# Altium schematic sheet INPUT_OUTPUT.SchDoc: FHGR_A3_landscape
size A3; Date: 18.07.2017; DrawnBy: G.P. Catregn; Organization: HTW Chur; Address1: Pulvermühlestrasse 57; Address2: 7004 Chur; Address3: Switzerland; DocumentNumber: 1; Revision: V1.0; SheetNumber: 2; SheetTotal: 3; DocumentName: HTW Template
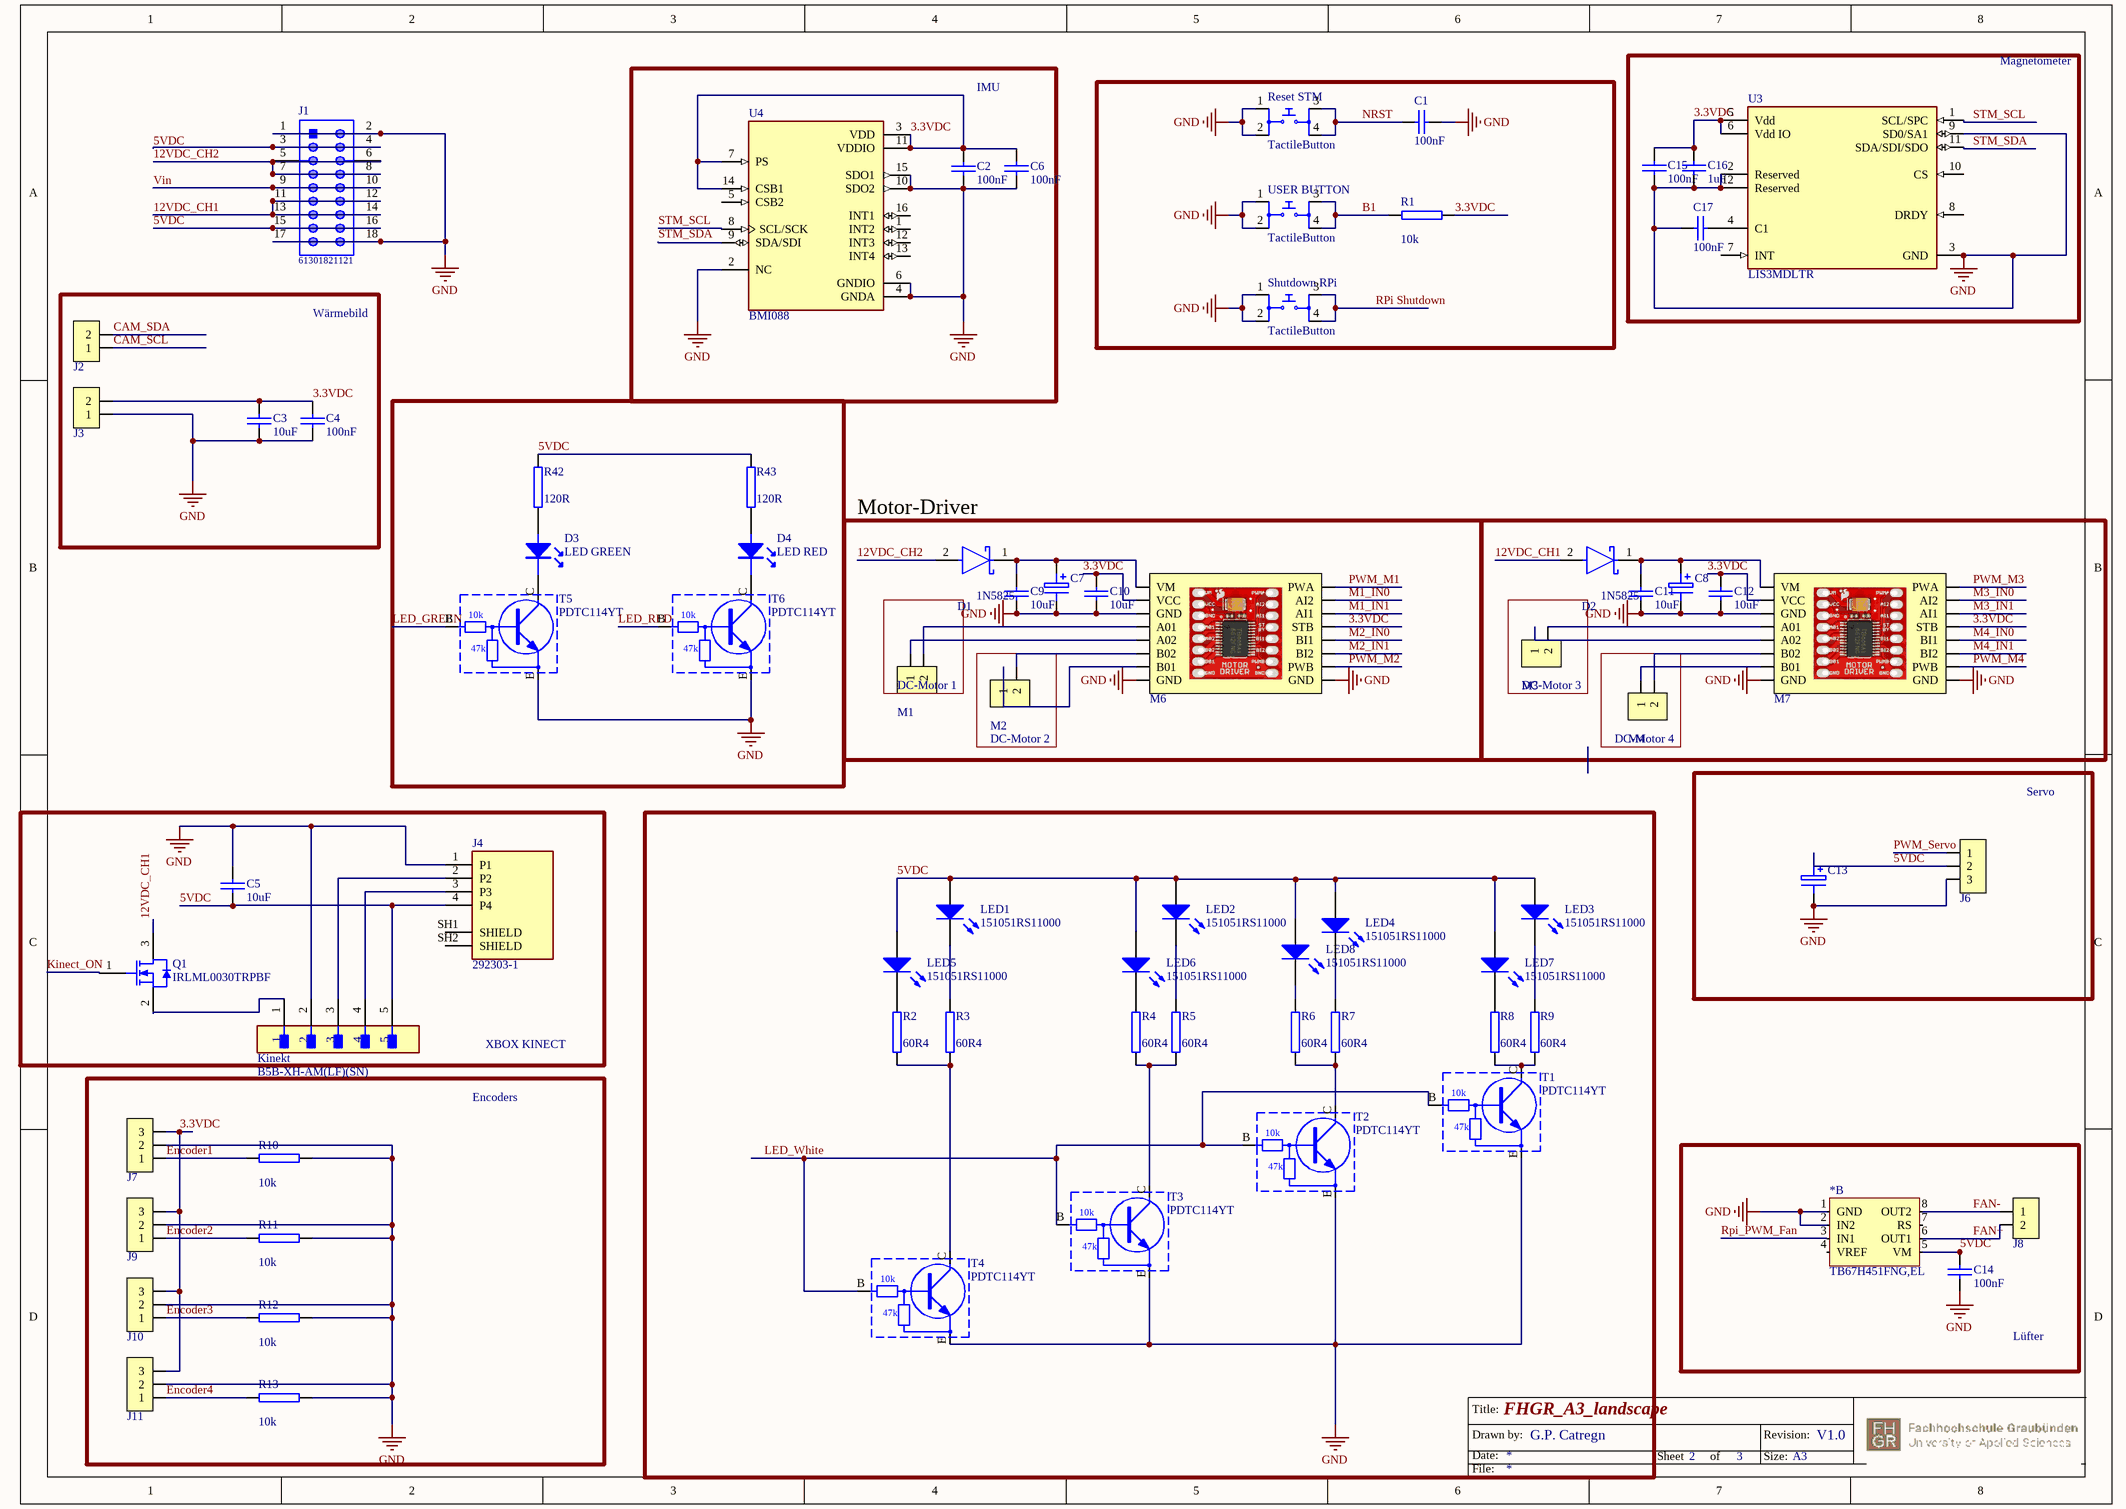
[diagram p0: INPUT_OUTPUT.SchDoc]

## Parts
*  TB67H451FNG,EL  [SOIC127P600X170_HS-9N]  (part B of 2)
C1  value 100nF  [0603]  (hidden comment: C 100nF 0603)
C2  value 100nF  [0603]  (hidden comment: C 100nF 0603)
C3  value 10uF  [0603]  (hidden comment: C 10uF 0603)
C4  value 100nF  [0603]  (hidden comment: C 100nF 0603)
C5  value 10uF  [0603]  (hidden comment: C 10uF 0603)
C6  value 100nF  [0603]  (hidden comment: C 100nF 0603)
C7  C 100uF ALUM  [PCAP_8x10-ELEC00]  (value not drawn)
C8  C 100uF ALUM  [PCAP_8x10-ELEC00]  (value not drawn)
C9  value 10uF  [0603]  (hidden comment: C 10uF 0603)
C10  value 10uF  [0603]  (hidden comment: C 10uF 0603)
C11  value 10uF  [0603]  (hidden comment: C 10uF 0603)
C12  value 10uF  [0603]  (hidden comment: C 10uF 0603)
C13  C 100uF ALUM  [PCAP_8x10-ELEC00]  (value not drawn)
C14  value 100nF  [0603]  (hidden comment: C 100nF 0603)
C15  value 100nF  [0603]  (hidden comment: C 100nF 0603)
C16  value 1uF  [0603]  (hidden comment: C 1uF 0603)
C17  value 100nF  [0603]  (hidden comment: C 100nF 0603)
D1  1N5825  [Microsemi_1N5825_0]  (value not drawn)
D2  1N5825  [Microsemi_1N5825_0]  (value not drawn)
D3  LED GREEN  [LED_1206]
D4  LED RED  [LED_1206]
J1  61301821121  [61301821121]
J2  2Pin_Male  [Header1x2_254]  (value not drawn)
J3  2Pin_Male  [Header1x2_254]  (value not drawn)
J4  292303-1  [TE_292303-1]
J6  3Pin_Male  [Header1x3_254]  (value not drawn)
J7  3Pin_Male  [Header1x3_254]  (value not drawn)
J8  2Pin_Male  [Header1x2_254]  (value not drawn)
J9  3Pin_Male  [Header1x3_254]  (value not drawn)
J10  3Pin_Male  [Header1x3_254]  (value not drawn)
J11  3Pin_Male  [Header1x3_254]  (value not drawn)
Kinekt  B5B-XH-AM(LF)(SN)  [FP-B5B-XH-AM_LF_SN-MFG]
LED1  151051RS11000  [Type 5mm]
LED2  151051RS11000  [Type 5mm]
LED3  151051RS11000  [Type 5mm]
LED4  151051RS11000  [Type 5mm]
LED5  151051RS11000  [Type 5mm]
LED6  151051RS11000  [Type 5mm]
LED7  151051RS11000  [Type 5mm]
LED8  151051RS11000  [Type 5mm]
M1  2Pin_Female  [OSTTE020104]  (value not drawn)
M2  2Pin_Female  [OSTTE020104]  (value not drawn)
M3  2Pin_Female  [OSTTE020104]  (value not drawn)
M4  2Pin_Female  [OSTTE020104]  (value not drawn)
M6  SPARKFUN_ROB_14451  [SPARKFUN_ROB_14451]  (value not drawn)
M7  SPARKFUN_ROB_14451  [SPARKFUN_ROB_14451]  (value not drawn)
Q1  IRLML0030TRPBF  [INTR-SOT-23-3_V]
R1  value 10k  [0805]  (hidden comment: R 10K 0805)
R2  value 60R4  [0805]  (hidden comment: R 60R4 0805)
R3  value 60R4  [0805]  (hidden comment: R 60R4 0805)
R4  value 60R4  [0805]  (hidden comment: R 60R4 0805)
R5  value 60R4  [0805]  (hidden comment: R 60R4 0805)
R6  value 60R4  [0805]  (hidden comment: R 60R4 0805)
R7  value 60R4  [0805]  (hidden comment: R 60R4 0805)
R8  value 60R4  [0805]  (hidden comment: R 60R4 0805)
R9  value 60R4  [0805]  (hidden comment: R 60R4 0805)
R10  value 10k  [0805]  (hidden comment: R 10K 0805)
R11  value 10k  [0805]  (hidden comment: R 10K 0805)
R12  value 10k  [0805]  (hidden comment: R 10K 0805)
R13  value 10k  [0805]  (hidden comment: R 10K 0805)
R42  value 120R  [0805]  (hidden comment: R 120R 0805)
R43  value 120R  [0805]  (hidden comment: R 120R 0805)
Reset_STM  TactileButton  [TactileButton-6x6mm]
Shutdown_RPi  TactileButton  [TactileButton-6x6mm]
T1  PDTC114YT  [SOT-23]
T2  PDTC114YT  [SOT-23]
T3  PDTC114YT  [SOT-23]
T4  PDTC114YT  [SOT-23]
T5  PDTC114YT  [SOT-23]
T6  PDTC114YT  [SOT-23]
U3  LIS3MDLTR  [FP-VFLGA-12-8365767-MFG]
U4  BMI088  [PQFN50P450X300X100-16N]
USER_BUTTON  TactileButton  [TactileButton-6x6mm]

## Blocks framed on the sheet
IMU: C2 C6 U4
Magnetometer: C15-C17 U3
Wärmebild: C3 C4 J2 J3
Motor-Driver: C7 C9 C10 D1 M6
DC-Motor 1: M1
DC-Motor 3: M3
DC-Motor 2: M2
DC-Motor 4: M4
Servo: C13 J6
XBOX KINECT: C5 J4 Kinekt Q1
Encoders: J7 J9-J11 R10-R13
Lüfter: * C14 J8

## Nets
GND: *.1(GND) *.2(IN2) C1.2 C2.2 C3.2 C4.2 C5.1 C6.2 C7.2 C8.2 C9.2 C10.2 C11.2 C12.2 C13.2 C14.2 C15.2 C16.2 C17.1 J1.1 J1.2 J1.17 J1.18 J3.1 J4.1(P1) J6.3 J7.2 J9.2 J10.2 J11.2 Kinekt.2 M6.3(GND) M6.8(GND) M6.9(GND) M7.3(GND) M7.8(GND) M7.9(GND) R10.2 R11.2 R12.1 R13.2 Reset_STM.1 Reset_STM.2 Shutdown_RPi.1 Shutdown_RPi.2 T1.E T2.E T3.E T4.E T5.E T6.E U3.2(Reserved) U3.3(GND) U3.9(SD0/SA1) U3.12(Reserved) U4.2(NC) U4.4(GNDA) U4.6(GNDIO) U4.10(SDO2) U4.15(SDO1) USER_BUTTON.1 USER_BUTTON.2
3.3VDC: C2.1 C3.1 C4.1 C6.1 C10.1 C12.1 C15.1 C16.1 J3.2 J7.3 J9.3 J10.3 J11.3 M6.2(VCC) M6.13(STB) M7.2(VCC) M7.13(STB) R1.2 U3.5(Vdd) U3.6(Vdd_IO) U4.3(VDD) U4.7(PS) U4.11(VDDIO) U4.14(CSB1)
5VDC: *.5(VM) C5.2 C13.1 C14.1 J1.3 J1.4 J1.15 J1.16 J4.4(P4) J6.2 Kinekt.5 LED1.2(A) LED2.2(A) LED3.2(A) LED4.2(A) LED5.2(A) LED6.2(A) LED7.2(A) LED8.2(A) R42.2 R43.2
12VDC_CH1: D2.2(A) J1.11 J1.12 J1.13 J1.14 Q1.3(D)
12VDC_CH2: D1.2(A) J1.5 J1.6 J1.7 J1.8
B1: R1.1 USER_BUTTON.3 USER_BUTTON.4
CAM_SCL: J2.1
CAM_SDA: J2.2
Encoder1: J7.1 R10.1
Encoder2: J9.1 R11.1
Encoder3: J10.1 R12.2
Encoder4: J11.1 R13.1
FAN+: *.6(OUT1) J8.2
FAN-: *.8(OUT2) J8.1
Kinect_ON: Q1.1(G)
LED_GREEN: T5.B
LED_RED: T6.B
LED_White: T1.B T2.B T3.B T4.B
M1_IN0: M6.15(AI2)
M1_IN1: M6.14(AI1)
M2_IN0: M6.12(BI1)
M2_IN1: M6.11(BI2)
M3_IN0: M7.15(AI2)
M3_IN1: M7.14(AI1)
M4_IN0: M7.12(BI1)
M4_IN1: M7.11(BI2)
NRST: C1.1 Reset_STM.3 Reset_STM.4
PWM_M1: M6.16(PWA)
PWM_M2: M6.10(PWB)
PWM_M3: M7.16(PWA)
PWM_M4: M7.10(PWB)
PWM_Servo: J6.1
RPi Shutdown: Shutdown_RPi.3 Shutdown_RPi.4
Rpi_PWM_Fan: *.3(IN1)
STM_SCL: U3.1(SCL/SPC) U4.8(SCL/SCK)
STM_SDA: U3.11(SDA/SDI/SDO) U4.9(SDA/SDI)
Vin: J1.9 J1.10
NetC7_1: C7.1 C9.1 D1.1(C) M6.1(VM)
NetC8_1: C8.1 C11.1 D2.1(C) M7.1(VM)
NetC17_2: C17.2 U3.4(C1)
NetD3_A: D3.A R42.1
NetD3_K: D3.K T5.C
NetD4_A: D4.A R43.1
NetD4_K: D4.K T6.C
NetJ4_2: J4.2(P2) Kinekt.3
NetJ4_3: J4.3(P3) Kinekt.4
NetKinekt_1: Kinekt.1 Q1.2(S)
NetLED1_1: LED1.1(K) R3.2
NetLED2_1: LED2.1(K) R5.2
NetLED3_1: LED3.1(K) R9.2
NetLED4_1: LED4.1(K) R7.2
NetLED5_1: LED5.1(K) R2.2
NetLED6_1: LED6.1(K) R4.2
NetLED7_1: LED7.1(K) R8.2
NetLED8_1: LED8.1(K) R6.2
NetM1_1: M1.1 M6.5(A02)
NetM1_2: M1.2 M6.4(A01)
NetM2_1: M2.1 M6.7(B01)
NetM2_2: M2.2 M6.6(B02)
NetM3_1: M3.1 M7.5(A02)
NetM3_2: M3.2 M7.4(A01)
NetM4_1: M4.1 M7.7(B01)
NetM4_2: M4.2 M7.6(B02)
NetR2_1: R2.1 R3.1 T4.C
NetR4_1: R4.1 R5.1 T3.C
NetR6_1: R6.1 R7.1 T2.C
NetR8_1: R8.1 R9.1 T1.C

Not connected (* = marked no-connect by the designer): * 4(VREF) 7(RS); J4 SH1(SHIELD) SH2(SHIELD); U3 7(INT) 8(DRDY) 10(CS); U4 1(INT2) 5(CSB2) 12(INT3) 13(INT4) 16(INT1)

## Notes on the sheet
- Drawn by:
- Title:
- Date:
- Sheet
- of
- Size:
- Revision:
- A3
- File:
- (in symbol T_PDTC114YT) 10k; 47k

## Library data of the parts
C1 C2 C4 C6 C14 C15 C17 = C_100nF_0603: TempKoeff: Y5V; Tolerance: -20%/+80%; Voltage: 50V; Part ID: C_100nF_0603; Price 1pc (CHF): 0.1; Supplier 1: Digi-Key; Supplier Part Number 1: 1276-1012-1-ND
C3 C5 C9-C12 = C_10uF_0603: TempKoeff: X5R; Tolerance: 10%; Voltage: 16V; Part ID: C_10uF_0603; Price 1pc (CHF): 0.40; Supplier 1: Digi-Key; Supplier Part Number 1: 490-12317-1-ND
C7 C8 C13 = C_100uF_ALUM: Tolerance: 20%; Voltage: 50V; VALUE: 100uF; Part ID: C_100uF_ALUM; Price 1pc (CHF): 0.51; Supplier 1: Digi-Key; Supplier Part Number 1: 493-2226-1-ND
C16 = C_1uF_0603: TempKoeff: X7R; Tolerance: 10%; Voltage: 25V; Part ID: C_1uF_0603; Price 1pc (CHF): 0.29; Supplier 1: Digi-Key; Supplier Part Number 1: 1276-6617-1-ND
D3 = LED_GREEN_1206: Peak Wavelenght: 565nm; Part ID: LED_GREEN_1206; Price 10pcs: 0.226; Supplier 1: Digi-Key; Supplier Part Number 1: 67-1357-1-ND; ComponentLink1Description: Datasheet; ComponentLink1URL: https://media.digikey.com/pdf/Data%20Sheets/Lite-On%20PDFs/LTST-C230KGKT.pdf
D4 = LED_RED_1206: Peak Wavelenght: 639nm; Part ID: LED_RED_1206; Price 10pcs: 0.233; Supplier 1: Digi-Key; Supplier Part Number 1: 160-1457-1-ND; ComponentLink1Description: Datasheet; ComponentLink1URL: https://media.digikey.com/pdf/Data%20Sheets/Lite-On%20PDFs/LTST-C230KRKT.pdf
J1 = CMP-1502-01101-1: THT Vertical Pin Header WR-PHD, Pitch 2.54 mm, Dual Row, 18 pins; Manufacturer: Wurth Elektronik; Withstanding Voltage: 500VAC; Pin Number: 18; Pitch: 2.54mm; Rated Current: 3A; Contact Resistance: 20mOhm; Gender: Male; Working Voltage: 250VAC; Publisher: WurthElektronik; Packaging: Bag; Row Number: Dual; Datasheet URL: https://katalog.we-online.de/em/datasheet/6130xx21121.pdf; Mounting Technology: THT; Orientation: Vertical; Part Number: 61301821121; Package Reference: 61301821121; Manufacturer URL: http://www.we-online.de; Operating Temperature: -40to105degC
J2 J3 J8 = Header_2: Part ID: Header_2; Price 1pc (CHF): 0.13; Supplier 1: Digi-Key; ComponentLink1Description: Datasheet; ComponentLink1URL: https://katalog.we-online.de/em/datasheet/6130xx11121.pdf; Supplier Part Number 1: 732-5315-ND
J4 = 292303-1: CONN USB RECEPT R/A TYPE A 4POS; Value: *; MP: 292303-1; Package: None; Availability: Unavailable; Price: None
J6 J7 J9-J11 = Header_3: Part ID: Header_3; Price 1pc (CHF): 0.12; Supplier 1: Digi-Key; ComponentLink1Description: Datasheet; ComponentLink1URL: https://www.we-online.com/katalog/datasheet/6130xx11121.pdf; Supplier Part Number 1: 732-5316-ND
Kinekt = CMP-17439-000304-1: CONN HEADER VERT 5POS 2.5MM; Mated Stacking Heights: 9.8mm; Voltage Rating: 250V; Max Current Rating: 3A; Number of Positions: 5; Contact Resistance: 20mR; Depth: 5.75mm; Connector Type: Header; Color: Green; Insulation Material: Nylon; Contact Plating: Copper; Length: 14.9mm; Fastening Type: Detent; Contact Material: Brass; Number of Rows: 1; Contact Type: Male Pin; Housing Material: Polyamide; Housing Color: White; Lead Free: Lead Free; Max Voltage Rating (AC): 250V; Mount: Through Hole; Contact Shape: Square; Min Operating Temperature: -25°C; Packaging: Bulk; Orientation: Straight; Insulation Color: Natural; Series: XH; Flammability Rating: UL94 V-0; Contact Finish - Mating: TIN; Max Operating Temperature: 85°C; Termination: Solder; Pitch: 2.5mm
LED1-LED8 = CMP-1488-00008-1: THT LED round mono-color color lens, WL-TMRW, Red; Manufacturer: Wuerth Elektronik; PackageReference: Type 5mm; PartNumber: 151051RS11000; ComponentLink2URL: http://katalog.we-online.de/pbs/datasheet/7448042001.pdfhttp://katalog.we-online.de/pbs/datasheet/7448042001.pdfhttp://katalog.we-online.de/pbs/datasheet/7448042001.pdfhttp://katalog.we-online.de/pbs/datasheet/151051RS11000.pdf; ComponentLink1URL: http://www.we-online.com; ComponentLink1Description: Manufacturer URL; ComponentLink2Description: Datasheet; Emitting color: Red
M1-M4 = Terminal_2Pin: Part ID: Terminal_2Pin; Price 1pc (CHF): 0.69; Supplier 1: Digi-Key; ComponentLink1Description: Datasheet; ComponentLink1URL: https://www.on-shore.com/wp-content/uploads/OSTTEXX0104.pdf; Supplier Part Number 1: ED2740-ND
M6 M7 = SPARKFUN_ROB_14451: Dual Motor Driver; Stecker: 2 x 732-5321-ND; Buchse: 2 x SAM1213-08-ND; Part ID: SPARKFUN_ROB_14451; Price 1pc (CHF): 4.5; Supplier 1: Digi-Key; ComponentLink1Description: Datasheet; ComponentLink1URL: https://media.digikey.com/pdf/Data%20Sheets/Sparkfun%20PDFs/ROB-14451_Web.pdf; Supplier Part Number 1: 1568-1756-ND
Q1 = CMP-2000-06483-1: HEXFET(R) Power MOSFET, 1.3 W, 4.4 ns, -55 to 150 degC, 3-Pin SOT-23, RoHS, Tape and Reel; Manufacturer: International Rectifier; Maximum Drain Source Resistance: 0.027Ω; Transistor Configuration: Single; Channel Mode: Enhancement; Maximum Power Dissipation: 1.3W; Typical Input Capacitance @ Vds: 382pF@15V; Maximum Gate Source Voltage: ±20V; Number of Elements per Chip: 1; Transistor Material: Si; Maximum Gate Threshold Voltage: 2.3V; Typical Turn-On Delay Time: 5.2ns; Maximum Drain Source Voltage: 30V; Typical Turn-Off Delay Time: 7.4ns; Minimum Gate Threshold Voltage: 1.3V; Channel Type: N; Typical Gate Charge @ Vgs: 2.6nC@4.5V; Maximum Continuous Drain Current: 5.3A; Pin Count: 3; Mounting Technology: SurfaceMount; Datasheet URL: https://datasheet.ciiva.com/4442/irlml0030pbf-90019-4442451.pdf; Datasheet Version: 02/2012; Maximum Operating Temperature: +150°C; Category: PowerMOSFET; Package Description: 3-Pin Small Outline Transistor, Body 2.92 x 1.3 mm, Pitch 0.95 mm; Manufacturer URL: http://internationalrectifier.com/; Height: 1.02mm; Minimum Operating Temperature: -55°C; Dimensions: 3.04x1.4x1.02mm; Package Reference: SOT-23-3; Package Type: SOT-23; Mounting Type: SurfaceMount; Length: 3.04mm; Width: 1.4mm
R1 R10-R13 = R_10k_0805: Tolerance: 1%; Power Dissipation: 125mW; Part ID: R_10k_0805; Price 10pcs (CHF): 0.021; Supplier 1: Digi-Key; Supplier Part Number 1: 311-10.0KCRCT-ND
R2-R9 = R_60R4_0805: Tolerance: 1%; Power Dissipation: 125mW; Part ID: R_60R4_0805; Price 10pcs (CHF): 0.042; Supplier 1: Digi-Key; Supplier Part Number 1: 311-60.4CRCT-ND
R42 R43 = R_120R_0805: Tolerance: 1%; Power Dissipation: 125mW; Part ID: R_120R_0805; Price 10pcs (CHF): 0.046; Supplier 1: Digi-Key; Supplier Part Number 1: A129738CT-ND
Reset_STM Shutdown_RPi USER_BUTTON = TactileButton: Voltage: 12V; Current: 50mA; Part ID: TactileButton; Price 1pc (CHF): 0.59; Dimension: 6.2mmx6.2mmx4.3mm; Supplier 1: Digi-Key; ComponentLink1Description: Datasheet; ComponentLink1URL: https://media.digikey.com/pdf/Data%20Sheets/APEM%20Components%20PDFs/ADTS6,%20ADTSM,%20AKTSC6%20Series.pdf; Supplier Part Number 1: 679-2380-1-ND
T1-T6 = T_PDTC114YT: Frequency: 230MHz; Voltage: 50V; Current: 100mA; Power Dissipation: 250mW; Part ID: T_PDTC114YT; Price 1pc (CHF): 0.18; ComponentLink1URL: https://assets.nexperia.com/documents/data-sheet/PDTC114Y_SER.pdf; ComponentLink1Description: Datasheet; Supplier 1: Digi-Key; Supplier Part Number 1: 1727-5134-6-ND
U3 = CMP-2000-07463-2: SENSOR MR I2C/SPI 12LGA; Manufacturer: STMicroelectronics; Sensor Output: I2C,SPI; Operating Supply Current: 40-270uA; Max Supply Voltage: 3.6V; Sensing Method: Magnetic; Min Supply Voltage: 1.71V; ComponentLink2URL: https://www.st.com/resource/en/datasheet/lis3mdl.pdf; Category: IC; Manufacturer Part Number: LIS3MDLTR; Octopart: https://octopart.com/lis3mdltr-stmicroelectronics-29403125; Automotive: No; ComponentLink2Description: Datasheet; RoHS: TRUE; Device Class L3: unset; Device Class L1: Sensors; Temperature: -40°C to +85°C; Height: 1mm; Mouser Description: Board Mount Hall Effect / Magnetic Sensors Ultra Lo-Pwr Hi Perf 3-Axis 1.9-3.6V; Temperature Range High: +85°C; Lead Free: Yes; Device Class L2: Magnetic Sensors; Footprint Url: https://www.st.com/content/ccc/resource/technical/document/technical_note/73/17/9c/16/dd/96/4a/01/CD00134799.pdf/files/CD00134799.pdf/jcr:content/translations/en.CD00134799.pdf; Temperature Range Low: -40°C; Package: VFLGA-12-8365767; Digikey Description: SENSOR MR I2C/SPI 12LGA
U4 = BMI088: High-performance 6-axis inertial sensor (accelerometer + gyroscope) <a href="https://pricing.snapeda.com/parts/BMI088/Bosch%20Sensortec/view-part?ref=eda">Check prices</a>; Package: None; MP: BMI088; Value: *; Availability: Unavailable; Price: None